# Altium schematic sheet ACTUATOR_PWR_PROT.SchDoc
size B; SheetNumber: 7; SheetTotal: 9
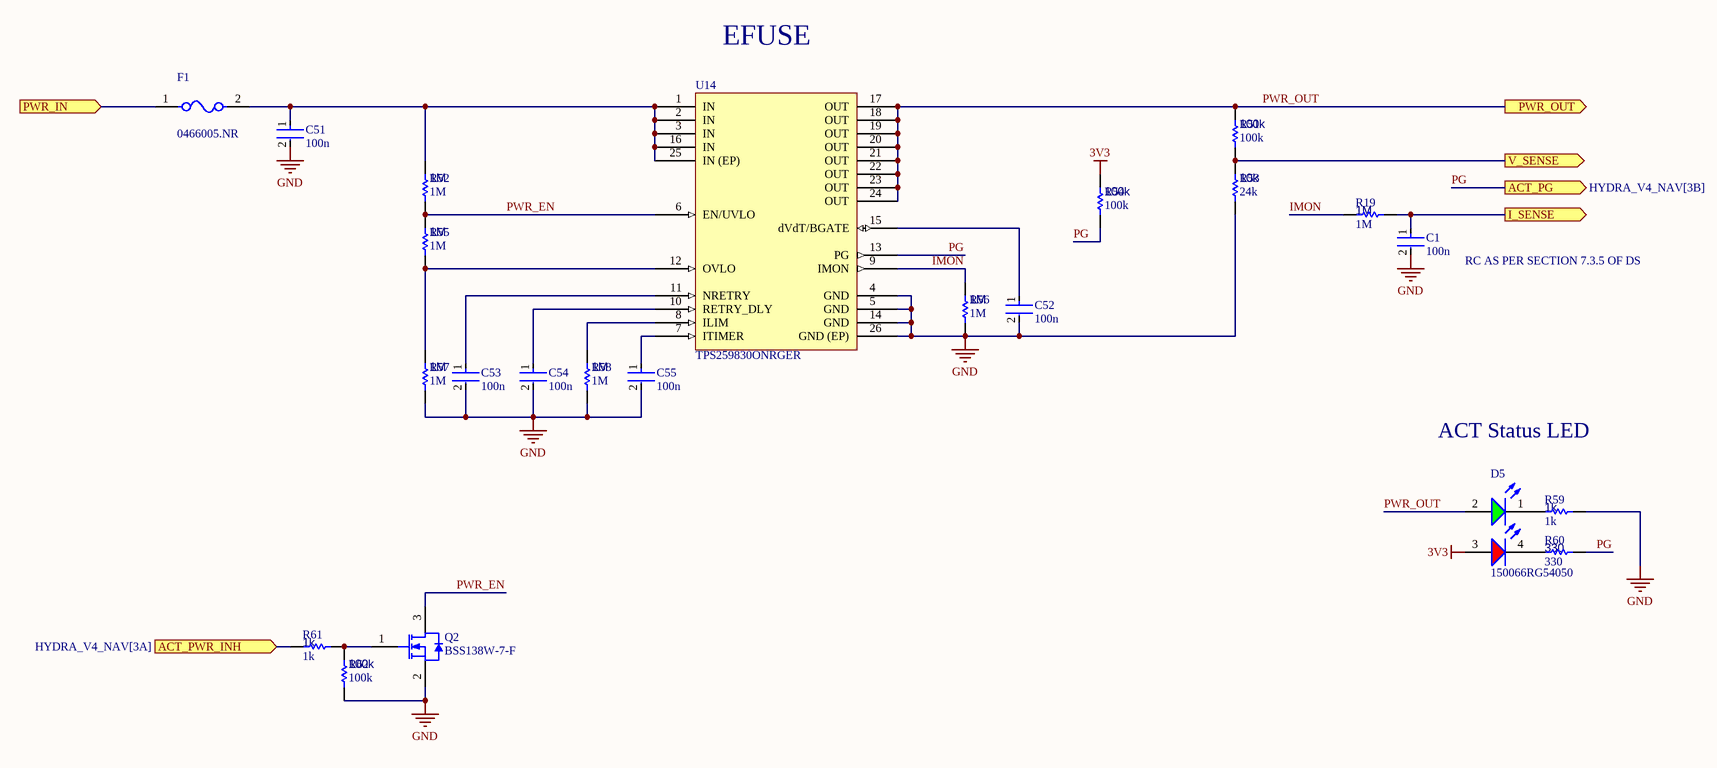
[diagram p0: ACTUATOR_PWR_PROT.SchDoc]

## Parts
C1  100n  [FP-0402-L_1_0_0_05-W_0_5-IPC_A]
C51  100n  [FP-0402-L_1_0_0_05-W_0_5-IPC_A]
C52  100n  [FP-0402-L_1_0_0_05-W_0_5-IPC_A]
C53  100n  [FP-0402-L_1_0_0_05-W_0_5-IPC_A]
C54  100n  [FP-0402-L_1_0_0_05-W_0_5-IPC_A]
C55  100n  [FP-0402-L_1_0_0_05-W_0_5-IPC_A]
D5  150066RG54050  [WL-SBCD_0606]
F1  0466005.NR  [FP-0466-MFG]
Q2  BSS138W-7-F  [DIOD-SOT323-3_V]
R19  1M  [R0603B]
R51  100k  [R0603B]
R52  1M  [R0603B]
R53  24k  value 10k  [R0603B]
R54  100k  [R0603B]
R55  1M  [R0603B]
R56  1M  [R0603B]
R57  1M  [R0603B]
R58  1M  [R0603B]
R59  1k  [R0603B]
R60  330  [R0603B]
R61  1k  [R0603B]
R62  100k  [R0603B]
U14  TPS259830ONRGER  [QFN50P400X400X100_HS-25N]

## Ports
ACT_PG (out, see HYDRA_V4_NAV[3B]), ACT_PWR_INH (in, see HYDRA_V4_NAV[3A]), I_SENSE (out, see HYDRA_V4_NAV[3A]), PWR_IN (in, see HYDRA_V4_NAV[3A]), PWR_OUT (out, see HYDRA_V4_NAV[3A]), V_SENSE (out, see HYDRA_V4_NAV[3A])

## Nets
3V3: D5.3(A) R54.1
GND: C1.2 C51.2 C52.2 C53.2 C54.2 C55.2 Q2.2(S) R53.2 R56.2 R57.2 R58.2 R59.2 R62.2 U14.4(GND) U14.5(GND) U14.14(GND) U14.26(GND_(EP))
ACT_PWR_INH: R61.1 ; port ACT_PWR_INH
I_SENSE: C1.1 R19.2 ; port I_SENSE
IMON: R19.1 R56.1 U14.9(IMON)
PG: R54.2 R60.2 U14.13(PG) ; port ACT_PG
PWR_EN: Q2.3(D) R52.2 R55.1 U14.6(EN/UVLO)
PWR_IN: F1.1 ; port PWR_IN
PWR_OUT: D5.2(A) R51.1 U14.17(OUT) U14.18(OUT) U14.19(OUT) U14.20(OUT) U14.21(OUT) U14.22(OUT) U14.23(OUT) U14.24(OUT) ; port PWR_OUT
V_SENSE: R51.2 R53.1 ; port V_SENSE
NetC51_1: C51.1 F1.2 R52.1 U14.1(IN) U14.2(IN) U14.3(IN) U14.16(IN) U14.25(IN_(EP))
NetC52_1: C52.1 U14.15(dVdT/BGATE)
NetC53_1: C53.1 U14.11(NRETRY)
NetC54_1: C54.1 U14.10(RETRY_DLY)
NetC55_1: C55.1 U14.7(ITIMER)
NetD5_1: D5.1(K) R59.1
NetD5_4: D5.4(K) R60.1
NetQ2_1: Q2.1(G) R61.2 R62.1
NetR55_2: R55.2 R57.1 U14.12(OVLO)
NetR58_1: R58.1 U14.8(ILIM)

## Notes on the sheet
- EFUSE
- RC AS PER SECTION 7.3.5 OF DS
- ACT Status LED

## Library data of the parts
C1 C51-C55 = CMP-001-00058-1: LARGE PADS, 0402 CAP, CHANGE COMMENT TO MATCH REAL P/N; Capacitor Type: Ceramic; Value: 100n; Min Operating Temperature: -55°C; Mounting Technology: Surface Mount; Pins: 2; Case/Package: 0402; RoHS Compliant: Yes; Max Operating Temperature: 85°C
D5 = CMP-004-00040-2: Led, Red/Grn, 180Mcd/230Mcd, 624Nm/525Nm Rohs Compliant: Yes; Source: rgled.SchLib; Component Type: Standard; Design Item ID: CMP-004-00034-2; Pins: 4
F1 = CMP-08605-000032-1: FUSE BOARD MNT 5A 32VAC/VDC 1206; Manufacturer: Littelfuse Inc; Value: 0.011Ω; Max Fuse Ac Voltage: 32V; Fuse I2T: 2.5A2Sec; Fuse Interrupt Ac Current: 50A; Fuse Blow Speed: Fast; Fuse Voltage Drop: 73.75mV; Category: Fuse; Temperature: -55°C to +90°C; Lead Free: Yes; Temperature Range High: +90°C; RoHS: TRUE; Device Class L2: Fuses; ComponentLink2URL: https://www.littelfuse.com/~/media/electronics/datasheets/fuses/littelfuse_fuse_466_datasheet.pdf.pdf; Fuse Current: 5A; Octopart: https://octopart.com/0466005.nr-littelfuse-143206; Automotive: No; Max Fuse Dc Voltage: 32V; Temperature Range Low: -55°C; Device Class L3: unset; ComponentLink2Description: Datasheet; Manufacturer Part Number: 0466005.NR; Fuse Interrupt Dc Current: 50A; Resistance: 0.011Ω; Package: 0466; Device Class L1: Circuit Protection; Mouser Description: Surface Mount Fuses 32V 5A VFA Slimline; Height: 0.66mm; Voltage Rating: 32V; Digikey Description: FUSE BOARD MNT 5A 32VAC/VDC 1206
Q2 = CMP-2000-05968-1: N-Channel Enhancement Mode Mosfet, 50 V, 200 mA, -55 to 150 degC, 6-Pin SOT-323, RoHS, Tape and Reel; Typical Turn-Off Delay Time: 20ns; Number of Channels: 1Channel; Type: EnhancementModeFieldEffectTransistor; Brand: DiodesIncorporated; Vds - Drain-Source Breakdown Voltage: 75V; Vgs - Gate-Source Voltage: 20V; Rds On - Drain-Source Resistance: 1.4Ohms; Transistor Type: 1N-Channel; Configuration: Single; Unit Weight: 0.000212oz; Pd - Power Dissipation: 200mW; Id - Continuous Drain Current: 200mA; Forward Transconductance - Min: 0.1S; Manufacturer URL: http://www.diodes.com/; Series: BSS138; Package Description: 3-Pin Small Outline Transistor, Body 2 x 1.25 mm, Pitch 0.65 mm; Mounting Technology: SurfaceMount; Product Category: MOSFET; RoHS: True; Maximum Operating Temperature: +150C; Height: 1mm; Length: 2.2mm; Technology: Si; Width: 1.35mm; Datasheet URL: http://www.diodes.com/_files/datasheets/ds30206.pdf; Manufacturer: DiodesIncorporated; Package / Case: SOT-323-3; Typical Turn-On Delay Time: 20ns; Transistor Polarity: N-Channel; Factory Pack Quantity: 3000; Packaging: Reel; Product: MOSFETSmallSignal; Datasheet Version: Rev. 11-2, 09/2013; Package Reference: SOT323; Minimum Operating Temperature: -55C; Mounting Style: SMD/SMT; Channel Mode: Enhancement
R19 R51-R62 = CMP-009-00002-14: Resistor
  R19 R52 R55-R58: Value: 1M
  R51 R54 R62: Value: 100k
  R59 R61: Value: 1k
  R60: Value: 330
U14 = CMP-019-00050-3: 2.7-V to 26-V, 2.7-mΩ 18-A integrated hot-swap eFuse with current monitor and blocking FET driver 24-VQFN -40 to 125